# Altium schematic sheet lps_regulator_3_2.SchDoc
size B; Revision: B
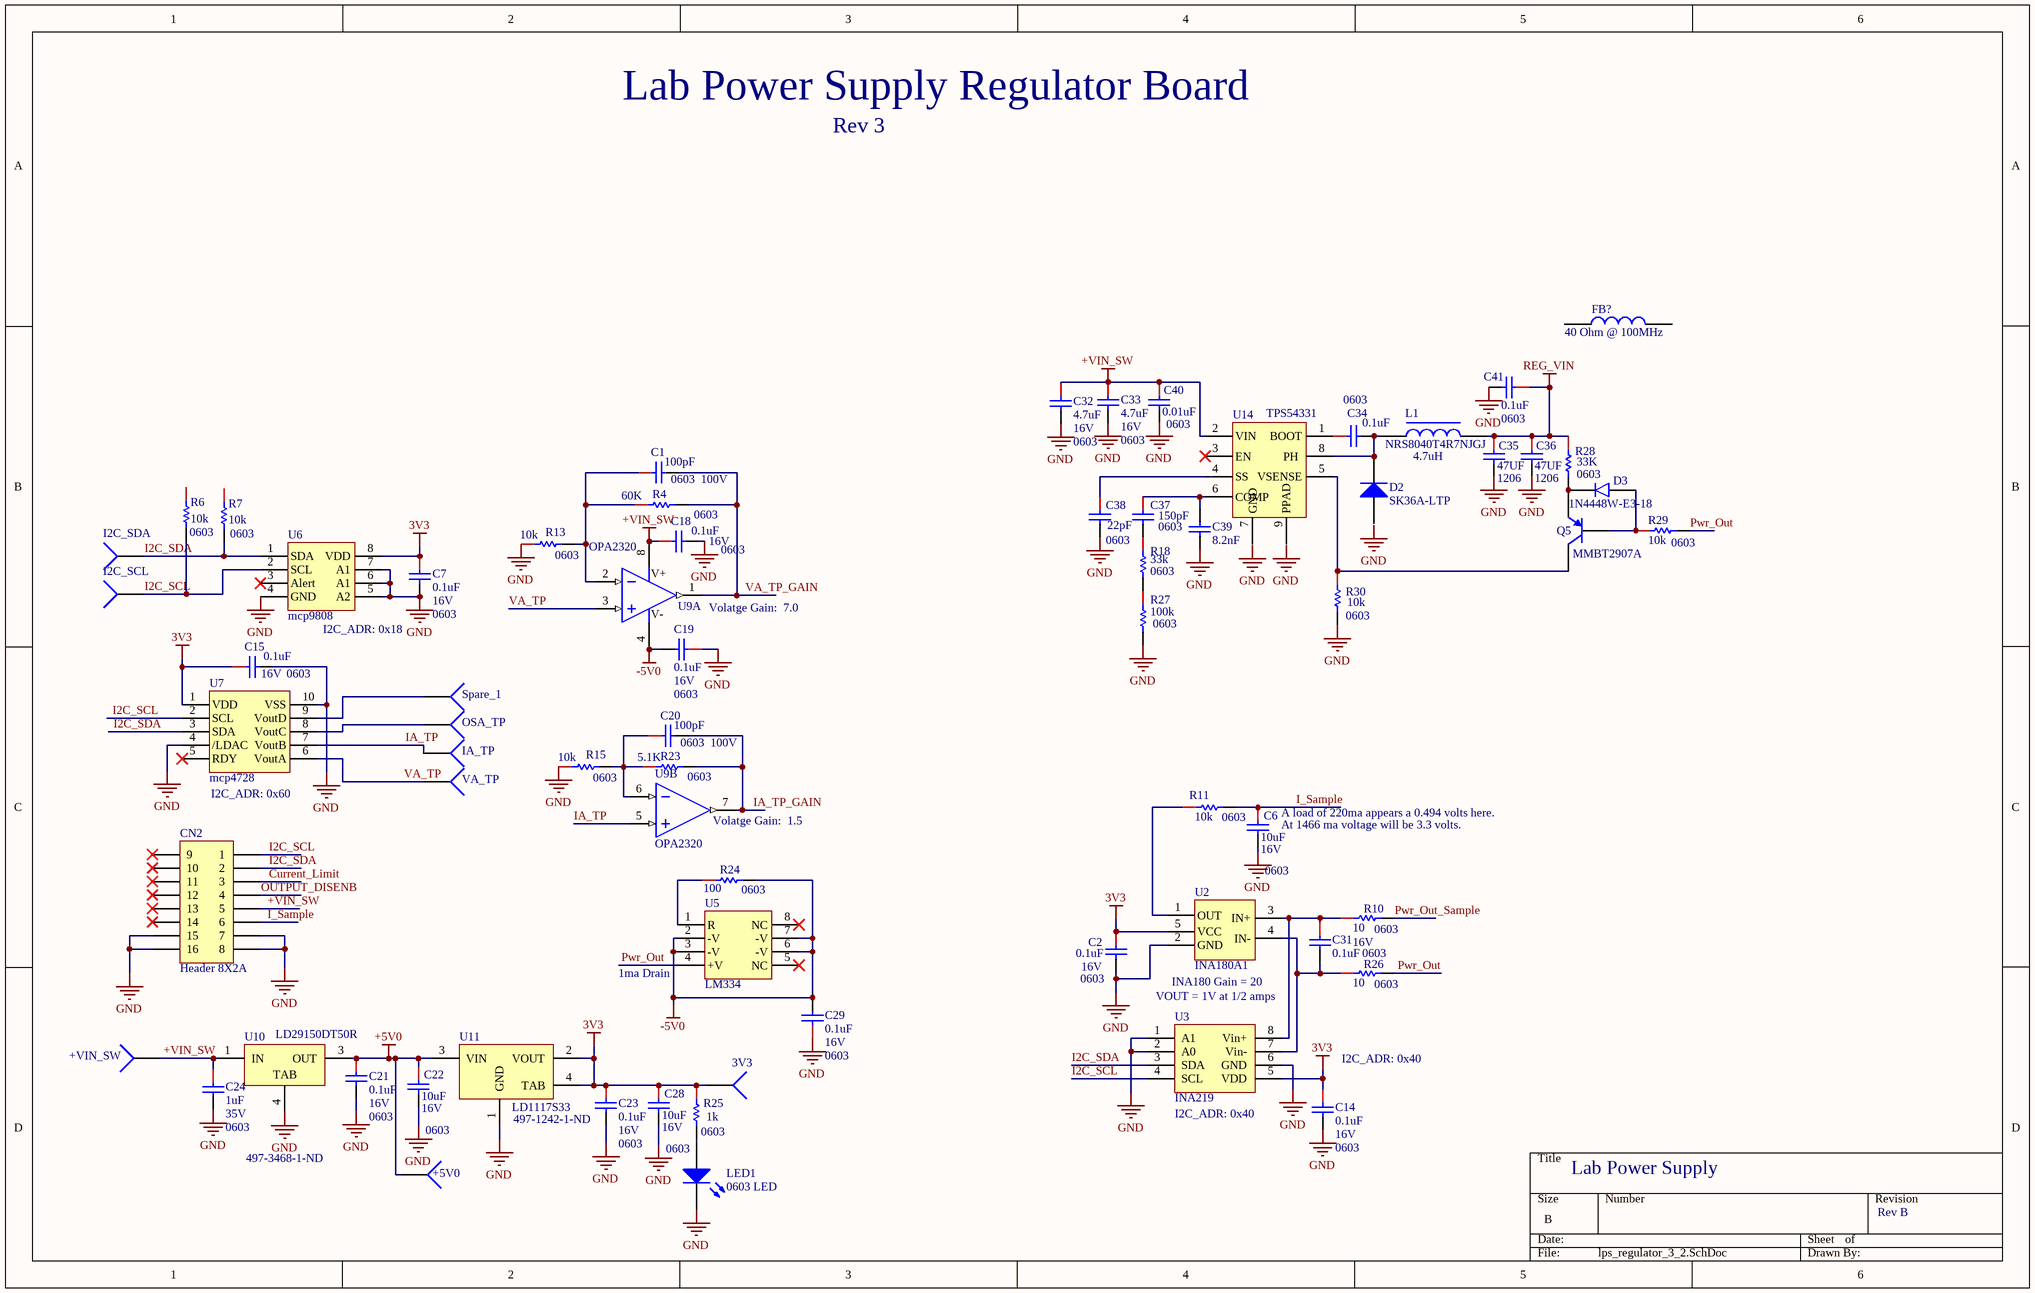
[diagram p0: lps_regulator_3_2.SchDoc]

## Parts
3V3  TestPoint_BLK  [TestPoint-TH 42 mil]  (value not drawn)
+5V0  TestPoint_BLK  [TestPoint-TH 42 mil]  (value not drawn)
+VIN_SW  TestPoint_BLK  [TestPoint-TH 42 mil]  (value not drawn)
C1  100pF  Voltage (Rated): 100V  Package (Imperial): 0603  [CAPC0603(1608)_N]
C2  0.1uF  Voltage (Rated): 16V  Package (Imperial): 0603  [CAPC0603(1608)_M]
C6  10uF  Voltage (Rated): 16V  Package (Imperial): 0603  [CAPC0603(1608)_N]
C7  0.1uF  Voltage (Rated): 16V  Package (Imperial): 0603  [CAPC0603(1608)_M]
C14  0.1uF  Voltage (Rated): 16V  Package (Imperial): 0603  [CAPC0603(1608)_N]
C15  0.1uF  Voltage (Rated): 16V  Package (Imperial): 0603  [CAPC0603(1608)_N]
C18  0.1uF  Voltage (Rated): 16V  Package (Imperial): 0603  [CAPC0603(1608)_M]
C19  0.1uF  Voltage (Rated): 16V  Package (Imperial): 0603  [CAPC0603(1608)_M]
C20  100pF  Voltage (Rated): 100V  Package (Imperial): 0603  [CAPC0603(1608)_N]
C21  0.1uF  Voltage (Rated): 16V  Package (Imperial): 0603  [CAPC0603(1608)_M]
C22  10uF  Voltage (Rated): 16V  Package (Imperial): 0603  [CAPC0603(1608)_N]
C23  0.1uF  Voltage (Rated): 16V  Package (Imperial): 0603  [CAPC0603(1608)_M]
C24  1uF  Voltage (Rated): 35V  Package (Imperial): 0603  [CAPC0603(1608)_M]
C28  10uF  Voltage (Rated): 16V  Package (Imperial): 0603  [CAPC0603(1608)_N]
C29  0.1uF  Voltage (Rated): 16V  Package (Imperial): 0603  [CAPC0603(1608)_M]
C31  0.1uF  Voltage (Rated): 16V  Package (Imperial): 0603  [CAPC0603(1608)_N]
C32  4.7uF  Voltage (Rated): 16V  Package (Imperial): 0603  [CAPC0603(1608)_M]
C33  4.7uF  Voltage (Rated): 16V  Package (Imperial): 0603  [CAPC0603(1608)_M]
C34  0.1uF  Package (Imperial): 0603  [CAPC0603(1608)_N]
C35  47UF  Package (Imperial): 1206  [CAPC1206(3216)_L]
C36  47UF  Package (Imperial): 1206  [CAPC1206(3216)_L]
C37  150pF  Package (Imperial): 0603  [CAPC0603(1608)_L]
C38  22pF  Package (Imperial): 0603  [CAPC0603(1608)_M]
C39  8.2nF  [CAPC1608X87X35LL15T15]
C40  0.01uF  Package (Imperial): 0603  [CAPC0603(1608)_N]
C41  0.1uF  Package (Imperial): 0603  [CAPC0603(1608)_N]
CN2  Header 8X2A  [HDR2X8_CEN]
D2  SK36A-LTP  [DO-214AC]
D3  1N4448W-E3-18  [SOD123]
FB?  40 Ohm @ 100MHz  [RESC0805(2012)_M]
I2C_SCL  TestPoint_BLK  [TestPoint-TH 42 mil]  (value not drawn)
I2C_SDA  TestPoint_BLK  [TestPoint-TH 42 mil]  (value not drawn)
IA_TP  TestPoint_BLK  [TestPoint-TH 42 mil]  (value not drawn)
L1  NRS8040T4R7NJGJ  [INDC8080X40N]
LED1  0603 LED  [SM-LED-0603]
OSA_TP  TestPoint_BLK  [TestPoint-TH 42 mil]  (value not drawn)
Q5  MMBT2907A  [SOT23]
R4  Package (Imperial): 0603  Resistance: 60K  [RESC0603(1608)_N]  (hidden comment: 100)
R6  Package (Imperial): 0603  [RESC0603(1608)_M]  (hidden comment: 10K)
R7  Package (Imperial): 0603  [RESC0603(1608)_M]  (hidden comment: 10K)
R10  Package (Imperial): 0603  Resistance: 10  [RESC0603(1608)_M]  (hidden comment: 10K)
R11  Package (Imperial): 0603  [RESC0603(1608)_M]  (hidden comment: 10K)
R13  Package (Imperial): 0603  Resistance: 10k  [RESC0603(1608)_M]  (hidden comment: 1.0K)
R15  Package (Imperial): 0603  Resistance: 10k  [RESC0603(1608)_M]  (hidden comment: 1.0K)
R18  Package (Imperial): 0603  [RESC0603(1608)_L]  (hidden comment: 33K)
R23  Package (Imperial): 0603  Resistance: 5.1K  [RESC0603(1608)_N]  (hidden comment: 100)
R24  Package (Imperial): 0603  [RESC0603(1608)_N]  (hidden comment: 100)
R25  Package (Imperial): 0603  Resistance: 1k  [RESC0603(1608)_M]  (hidden comment: 1.0K)
R26  Package (Imperial): 0603  Resistance: 10  [RESC0603(1608)_M]  (hidden comment: 10K)
R27  Package (Imperial): 0603  [RESC0603(1608)_M]  (hidden comment: 100K)
R28  Package (Imperial): 0603  Resistance: 33K  [RESC0603(1608)_M]  (hidden comment: 10K)
R29  Package (Imperial): 0603  [RESC0603(1608)_M]  (hidden comment: 10K)
R30  Package (Imperial): 0603  [RESC0603(1608)_M]  (hidden comment: 10K)
Spare_1  TestPoint_BLK  [TestPoint-TH 42 mil]  (value not drawn)
U2  INA180A1  [SOT-23-5_MC]
U3  INA219  [INA219]
U5  LM334  [LM334]
U6  mcp9808  [8MSOP]
U7  mcp4728  [MCP4728]
U9  OPA2320  [SOIC-8_NoPad]  (parts A,B of 2)
U10  LD29150DT50R  [TO-252_N]
U11  LD1117S33  [DSO-G3]
U14  TPS54331  [TPS54331]
VA_TP  TestPoint_BLK  [TestPoint-TH 42 mil]  (value not drawn)

## Nets
3V3: 3V3.1 C2.1 C7.1 C14.1 C15.1 C23.1 C28.1 R25.1 U2.5(VCC) U3.5(VDD) U6.8(VDD) U7.1(VDD) U11.2(VOUT) U11.4(TAB)
+5V0: +5V0.1 C21.1 C22.1 U10.3(OUT) U11.3(VIN)
+VIN_SW: +VIN_SW.1 C18.1 C24.1 C32.1 C33.1 C40.1 CN2.5 U9.8(V+) U10.1(IN) U14.2(VIN)
-5V0: C19.2 C29.2 R24.2 U5.2(-V) U5.3(-V) U5.6(-V) U5.7(-V) U9.4(V-)
GND: C2.2 C6.2 C7.2 C14.2 C15.2 C18.2 C19.1 C21.2 C22.2 C23.2 C24.2 C28.2 C29.1 C32.2 C33.2 C35.2 C36.2 C38.2 C39.1 C40.2 C41.2 CN2.7 CN2.8 CN2.15 CN2.16 LED1.2(Cathode) R13.1 R15.1 R27.2 R30.2 U2.2(GND) U3.1(A1) U3.2(A0) U3.6(GND) U6.4(GND) U6.5(A2) U6.6(A1) U6.7(A1) U7.4(/LDAC) U7.10(VSS) U10.4(TAB) U11.1(GND)
REG_VIN: C35.1 C36.1 C41.1 L1.2 R28.1
Current_Limit: CN2.3
I2C_SCL: CN2.1 I2C_SCL.1 R6.2 U3.4(SCL) U6.2(SCL) U7.2(SCL)
I2C_SDA: CN2.2 I2C_SDA.1 R7.2 U3.3(SDA) U6.1(SDA) U7.3(SDA)
I_Sample: C6.1 CN2.6 R11.2
IA_TP: IA_TP.1 U7.7(VoutB) U9.5(INB+)
IA_TP_GAIN: C20.2 R23.2 U9.7(OUTB)
OUTPUT_DISENB: CN2.4
Pwr_Out: R29.2 U5.4(+V)
Pwr_Out_Sample: R10.2
VA_TP: U7.6(VoutA) U9.3(INA+) VA_TP.1
VA_TP_GAIN: C1.2 R4.2 U9.1(OUTA)
NetC1_1: C1.1 R4.1 R13.2 U9.2(INA-)
NetC20_1: C20.1 R15.2 R23.1 U9.6(INB-)
NetC31_1: C31.1 R10.1 U2.3(IN+) U3.8(Vin+)
NetC31_2: C31.2 R26.1 U2.4(IN-) U3.7(Vin-)
NetC34_1: C34.1 U14.1(BOOT)
NetC34_2: C34.2 D2.2(K) L1.1 U14.8(PH)
NetC37_1: C37.1 C39.2 U14.6(COMP)
NetC37_2: C37.2 R18.1
NetC38_1: C38.1 U14.4(SS)
NetD3_1: D3.1(A) Q5.1(B) R29.1
NetD3_2: D3.2(C) Q5.2(E) R28.2
NetLED1_1: LED1.1(Anode) R25.2
NetOSA_TP_1: OSA_TP.1 U7.8(VoutC)
NetQ5_3: Q5.3(C) R30.1 U14.5(VSENSE)
NetR11_1: R11.1 U2.1(OUT)
NetR18_2: R18.2 R27.1
NetR24_1: R24.1 U5.1(R)
NetSpare_1_1: Spare_1.1 U7.9(VoutD)

Not connected (* = marked no-connect by the designer): CN2 9* 10* 11* 12* 13* 14*; D2 1(A); FB? 1 2; R6 1; R7 1; R26 2; U5 5(NC)* 8(NC)*; U6 3(Alert)*; U7 5(RDY)*; U14 3(EN)* 7(GND) 9(PPAD)

## Notes on the sheet
- Lab Power Supply Regulator Board
- Rev 3
- (near L1) 4.7uH
- I2C_ADR: 0x18
- Volatge Gain:  7.0
- (near U7) I2C_ADR: 0x60
- (near U9) Volatge Gain:  1.5
- (near C6) A load of 220ma appears a 0.494 volts here.
- (near C6) At 1466 ma voltage will be 3.3 volts.
- (near U5) 1ma Drain
- VOUT = 1V at 1/2 amps
- INA180 Gain = 20
- (near C14) I2C_ADR: 0x40
- 497-3468-1-ND
- 497-1242-1-ND
- (near U3) I2C_ADR: 0x40
- Lab Power Supply
- Rev B
- Labels drawn without touching a wire or pin: GND

## Library data of the parts
3V3 +5V0 +VIN_SW I2C_SCL I2C_SDA IA_TP OSA_TP Spare_1 VA_TP = CMP-005-0210-01: Test Point - Black; Manufacturer Part Number: 5001; Manufacturer: Keystone Electronics; Stock 1: 335679; Material: Base, Nylon 46, UL 94V-0; Terminal: 0.010" x 0.020" (0.25mm x 0.51mm) Phosphor Bronze Wire, Silver Plated; ComponentLink1URL: http://www.keyelco.com/product-pdf.cfm?p=1310; Packaging: Bulk; Mounting Type: 0.040" (1.02mm) Hole Diameter; Color: Black; Pin Count: 1; Component Name: TestPoint_BLK; Pricing 1: 1=0.37, 10=0.316, 50=0.2298, 100=0.2209, 250=0.19832, 500=0.18932, 1000=0.1616, 2500=0.14424, 5000=0.13523 (USD); ComponentLink1Description: http://www.keyelco.com/product-pdf.cfm?p=1310; RoHS: RoHS Compliant; Designator: TestPoint_BLK; Type: PC Test Point, Miniature
C1 C20 = CMP-007-0074-08: CAP CER 100PF 50V 5% NP0 0603; Package (Metric): 1608; Dielectric Material: Ceramic; Temperature Coefficient: C0G, NP0; Capacitance: 100pF; Tolerance: 5%; Mounting Type: SMD
C2 C7 C14 C15 C18 C19 C21 C23 C29 C31 C34 C41 = CMP-007-0042-08: CAP CER 0.1UF 16V 10% X7R 0603; Package (Metric): 1608; Dielectric Material: Ceramic; Capacitance: 100nF; Tolerance: 10%; Temperature Coefficient: X7R; Mounting Type: SMD
  C34 C41: Voltage (Rated): 16V
C6 C22 C28 = CMP-001-0603-12: CAP CER 10UF 16V X5R 0603; Capacitance: 10µF; Tolerance: 10%; Package (Metric): 1005; Dielectric Material: Ceramic; Temperature (Max): 85°C; Temperature (Min): -55°C; Height: 800µm; Mounting Type: SMD; Width: 800µm; Temperature Coefficient: X5R
C24 C37 = CMP-007-0109-08: CAP CER 1UF 35V 10% X5R 0603; Temperature (Min): -55°C; Temperature (Max): 85°C; Dielectric Material: Ceramic; Package (Metric): 1608; Capacitance: 1µF; Length: 1.6mm; Mounting Type: SMD; Height: 900µm; Tolerance: 10%; Temperature Coefficient: X5R; Width: 800µm
  C37: Voltage (Rated): 35V
C32 C33 = CMP-001-0597-12: CAP CER 4.7uF 16V X5R 0603; Temperature (Min): -55°C; Package (Metric): 1608; Capacitance: 4.7µF; Dielectric Material: Ceramic; Temperature (Max): 85°C; Tolerance: 10%; Height: 800µm; Mounting Type: SMD; Length: 1.6mm; Temperature Coefficient: X5R
C35 C36 = CMP-001-0623-11: CAP CER 47UF 25V 1206; Voltage (Rated): 100V; Temperature (Max): 85°C; Capacitance: 47µF; Temperature Coefficient: X5R; Package (Metric): 3216; Tolerance: 20%; Dielectric Material: Ceramic; Temperature (Min): -55°C; Length: 3.2mm; Mounting Type: SMD; Height: 1.6mm
C38 = CMP-007-0128-08: CAP CER 22PF 50V 5% NP0 0603; Dielectric Material: Ceramic; Package (Metric): 1608; Temperature Coefficient: C0G, NP0; Voltage (Rated): 50V; Tolerance: 5%; Capacitance: 22pF; Mounting Type: SMD
C39 = CMP-001-0751-01: CAP CER 820PF 50V X7R 0603; Dielectric Material: Ceramic; Dissipation Factor: 2.5%; Tolerance: 10%; Voltage Rating: 50V; REACH SVHC: No SVHC; Width: 0.8mm; Thickness: 0.034inch; Voltage Rating (DC): 50V; Mount: PCB, Surface Mount; Case Code (Imperial): 0603; Case/Package: 0603; Package Quantity: 1; Contact Plating: Matte, Tin; Length: 1.6mm; Min Operating Temperature: -55°C; Case Code (Metric): 1608; Capacitance: 820pF; Height: 0.8mm; Depth: 0.8mm; Lead Pitch: 0.7mm; Max Operating Temperature: 125°C; Voltage: 50V; Dielectric: X7R; Radiation Hardening: No; Packaging: Tape and Reel; Termination: SMD/SMT
C40 = CMP-007-0028-08: CAP CER 0.01uF 50V 10% X7R 0603; Temperature (Max): 125°C; Temperature (Min): -55°C; Dielectric Material: Ceramic; Capacitance: 10nF; Package (Metric): 1608; Voltage (Rated): 50V; Height: 900µm; Mounting Type: SMD; Temperature Coefficient: X7R; Width: 800µm; Tolerance: 10%; Length: 1.6mm
CN2 = CMP-001-0325-01: Header, 8-Pin, Dual row; Signal Integrity: Connector; Publisher: Altium Limited; Designator: Header 8X2A; LatestRevisionNote: Re-released for DXP Platform.; Pin Count: 16; Component Name: Header 8X2A; LatestRevisionDate: 17-Jul-2002
D2 = CMP-001-0130-02: DIODE SCHOTTKY 60V 3A; Manufacturer: Micro Commercial Co; Capacitance @ Vr, F: 250pF @ 4V, 1MHz; Current - Reverse Leakage @ Vr: 500µA @ 60V; Voltage - Forward (Vf) (Max) @ If: 750mV @ 3A; Speed: Fast Recovery =< 500ns, > 200mA (Io); Operating Temperature - Junction: -50°C ~ 125°C; RoHS: RoHS Compliant; Package / Case: DO-214AC, SMA; ComponentLink1Description: http://www.mccsemi.com/up_pdf/SK32A-LT~SK310A-LT(DO-214AC).PDF; Packaging: Cut Tape (CT); Component Name: SK36A-LTP; ComponentLink1URL: http://www.mccsemi.com/up_pdf/SK32A-LT~SK310A-LT(DO-214AC).PDF; Designator: SK36A-LTP; Mounting Type: Surface Mount; Current - Average Rectified (Io): 3A; Supplier Device Package: DO-214AC (SMA); Part Status: Active; Manufacturer Part Number: SK36A-LTP; Pricing 1: 1=0.6, 10=0.42, 25=0.3448, 100=0.276, 250=0.20072, 500=0.1631, 1000=0.12545, 2500=0.11291 (USD); Diode Type: Schottky; Pin Count: 2; Stock 1: 26020
D3 = CMP-001-0983-02: Diodes - General Purpose, Power, Switching 100 Volt 500mA 4ns; Max Repetitive Reverse Voltage (Vrrm): 100V; Max Reverse Voltage (DC): 75V; Forward Current: 150mA; Element Configuration: Single; Max Reverse Leakage Current: 5uA; Max Power Dissipation: 500mW; Max Surge Current: 500mA; Recovery Time: 4ns; Peak Non-Repetitive Surge Current: 500mA; Min Operating Temperature: -55°C; Package Quantity: 10000; Reverse Recovery Time: 4ns; Weight: 0.000363oz; Mount: Surface Mount; Packaging: Tape and Reel; Contact Plating: Tin; Average Rectified Current: 150mA; Max Operating Temperature: 150°C
FB? = FERRITE 40 OHM 1.5A 0805: 40 OHM 0805 1.5A; Manufacturer: Laird-Signal Integrity Products; Manufacturer Part Number: MI0805K400R-10; DC Resistance (DCR): 50 mOhm Max; Filter Type: Differential Mode - Single; Creator: osman; Supplier 1: Digi-Key; RoHS: RoHS Compliant; Category: Filters; Stock 1: 112318; Pricing 1: 1=0.1, 10=0.077, 25=0.07, 50=0.0628, 100=0.0461, 250=0.03352, 500=0.03074, 1000=0.02654 (USD); Packaging: Cut Tape (CT); Current Rating: 1.5A; Package / Case: 0805 (2012 Metric); Mounting Type: Surface Mount; Height (Max): 0.043" (1.10mm); Size / Dimension: 0.079" L x 0.049" W (2.00mm x 1.25mm); ComponentLink1URL: http://staging.lairdtech.com/WorkArea/linkit.aspx?LinkIdentifier=id&ItemID=4949; ComponentLink1Description: http://staging.lairdtech.com/WorkArea/linkit.aspx?LinkIdentifier=id&ItemID=4949; Supplier Part Number 1: 240-2389-1-ND; Impedance @ Frequency: 40 Ohm @ 100MHz
L1 = CMP-001-0686-01: INDUCTOR POWER 4.7UH 4.1A SMD; Test Frequency: 100kHz; DC Resistance (DCR): 18mR; Saturation Current: 5.4A; Tolerance: 30%; Self Resonant Frequency: 30MHz; Core Material: Ferrite; Shielding: Shielded; Width: 0.315inch; Case/Package: 8040; Min Operating Temperature: -25°C; Current Rating: 4.1A; Packaging: Tape and Reel; Depth: 8.2mm; Max Operating Temperature: 125°C; Lead Free: Lead Free; Mount: Surface Mount; REACH SVHC: Unknown; Number of Pins: 2; Radiation Hardening: No; Height: 4.2mm; Inductance Tolerance: 30%; Package Quantity: 1000; Length: 8mm; RMS Current (Irms): 4.1A; Inductance: 4.7uh; Lead Pitch: 5.6mm; Max DC Current: 5.4A; Termination: SMD/SMT; Halogen Free: Halogen Free
LED1 = CMP-001-0009-04: 0603 SMD LED; Pin Count: 2; Designator: 0603 LED
Q5 = MMBT2907A: PNP General Purpose Amplifier; Manufacturer: Fairchild Semiconductor; Vendor: Digikey; PN: MMBT2907AFSCT-ND; Current - Collector (Ic) (Max): 800mA; Voltage - Collector Emitter Breakdown (Max): 60V; Vce Saturation (Max) @ Ib, Ic: 1.6V @ 50mA, 500mA; DC Current Gain (hFE) (Min) @ Ic, Vce: 100 @ 150mA, 10V; Power - Max: 350mW; Frequency - Transition: 200MHz; MPN: MMBT2907A; Supplier 1: Digi-Key; Manufacturer Part Number: MMBT2907A; RoHS: RoHS Compliant; Category: Discrete Semiconductor Products; Stock 1: 74892; Pricing 1: 1=0.2, 10=0.187, 25=0.17, 100=0.1224, 250=0.07208, 500=0.0598, 1000=0.04079 (USD); Packaging: Cut Tape (CT); Transistor Type: PNP; Current - Collector Cutoff (Max): -; Mounting Type: Surface Mount; Package / Case: TO-236-3, SC-59, SOT-23-3; Supplier Device Package: SOT-23; ComponentLink1URL: http://www.fairchildsemi.com/ds/MM/MMBT2907A.pdf; ComponentLink1Description: http://www.fairchildsemi.com/ds/MM/MMBT2907A.pdf; Supplier Part Number 1: MMBT2907AFSCT-ND
R4 R23 R24 = CMP-007-0349-12: RES 100 OHM 1% 1/10W 0603 2017; Power: 100mW; Temperature Coefficient: ±100ppm/°C; Package (Metric): 1608; Termination: SMD/SMT; Tolerance: 1%; Height: 550µm; Operating Temperature: -55°C ~ 155°C
  R24: Resistance: 100
R6 R7 R10 R11 R26 R28-R30 = CMP-007-0359-12: RES 10K OHM 1/10W 1% 0603 SMD; Package (Metric): 1608; Power: 100mW; Temperature Coefficient: ±100ppm/°C; Height: 550µm; Termination: SMD/SMT; Tolerance: 1%
  R6 R7 R11 R29 R30: Resistance: 10k
R13 R15 R25 = CMP-007-0404-12: RES 1K OHM 1% 1/10W 0603; Temperature Coefficient: ±100ppm/°C; Power: 100mW; Package (Metric): 2012; Operating Temperature: -55°C ~ 155°C; Tolerance: 1%; Termination: SMD/SMT; Height: 550µm
R18 = CMP-007-0480-12: RES 33K OHM 1/10W 5% 0603 SMD; Temperature Coefficient: ±200ppm/°C; Power: 100mW; Package (Metric): 1608; Termination: SMD/SMT; Tolerance: 5%; Resistance: 33k; Height: 550µm
R27 = CMP-007-0353-12: RES 100K OHM 1% 1/10W 0603; Temperature Coefficient: ±100ppm/°C; Power: 100mW; Package (Metric): 1608; Resistance: 100k; Operating Temperature: -55°C ~ 155°C; Tolerance: 1%; Height: 550µm; Termination: SMD/SMT
U3 = INA219: Current Monitor IC
U5 = LM334: LM334, Current source
U9 = CMP-006-0027-01: Dual Single Supply Rail-to-Rail OpAmp; Manufacturer Part Number: OPA2320AIDR; Manufacturer: Texas Instruments; Amplifier Type: General Purpose; Voltage - Supply, Single/Dual (±): 1.8 V ~ 5.5 V, ±0.9 V ~ 2.75 V; Current - Supply: 1.45mA; Slew Rate: 10 V/µs; Source: OLogic-OpAmps.SCHLIB; Part Status: Active; Output Type: Rail-to-Rail; Packaging: Cut Tape (CT); Supplier Device Package: 8-SOIC; Pin Count: 8; Stock 1: 3660; RoHS: RoHS Compliant; Base Part Number: OPA2320; ComponentLink1Description: http://www.ti.com/lit/ds/symlink/opa2320.pdf; Component Name: OPA2320; Package / Case: 8-SOIC (0.154", 3.90mm Width); Designator: OPA2320; ComponentLink1URL: http://www.ti.com/lit/ds/symlink/opa2320.pdf; Mounting Type: Surface Mount; Operating Temperature: -40°C ~ 125°C; Pricing 1: 1=3, 10=2.697, 100=2.2094, 500=1.88078, 1000=1.5862 (USD)
U10 = CMP-001-0685-01: STMICROELECTRONICS         LD29150DT33R            Fixed LDO Voltage Regulator, 4.3V to 30V, 400mV Dropout, 3.3Vout, 1.5Aout, TO-252-3; Min Output Voltage: 3.3V; Reference Voltage: 1.2423V; Polarity: Positive; Output Voltage Accuracy: 1%; Number of Outputs: 1; Max Output Voltage: 3.333V; Max Output Current: 1.5A; Quiescent Current: 15mA; Min Operating Temperature: -40°C; Packaging: Tape and Reel; Case/Package: TO-252; Weight: 0.01lb; Min Input Voltage: 4.3V; Nominal Output Voltage: 3.3V; Termination: SMD/SMT; Output Voltage: 3.3V; Width: 6.2mm; Radiation Hardening: No; Accuracy: 1%; Lead Free: Lead Free; Number of Pins: 3; Contact Plating: Matte, Tin; Mount: Surface Mount; Package Quantity: 1; Number of Regulators: 1; Max Supply Voltage: 30V; Output Current: 1.5A; Output Type: Fixed; Dropout Voltage: 400mV; REACH SVHC: No SVHC; Min Supply Voltage: 4.3V; Input Bias Current: 15mA; Max Input Voltage: 30V; Height: 2.4mm; Max Operating Temperature: 125°C; Length: 6.6mm
U11 = CMP-008-0010-01: 3.3 volt fixed regulator, 800mA; Pin Count: 4; Designator: LD1117S33; Component Name: LD1117S33